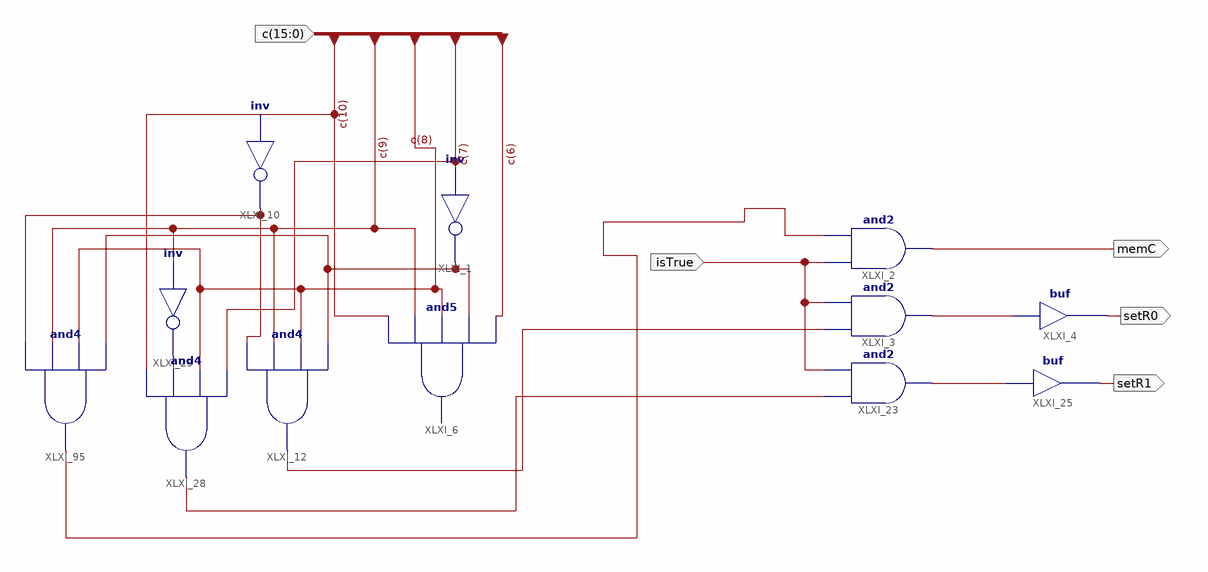
[diagram p0: schematic sheet 1]
// Xilinx ISE schematic MVI.sch (spartan3e) as structural Verilog: 12 symbols, 5 ports
module MVI (
  input  isTrue,
  input  [15:0] c,
  output setR1,
  output setR0,
  output memC
);

  wire XLXN_27, XLXN_35, XLXN_37, XLXN_61, XLXN_62, XLXN_66, XLXN_180, XLXN_186;

  not XLXI_10 (XLXN_35, c[10]);
  not XLXI_29 (XLXN_62, c[9]);
  and XLXI_28 (XLXN_66, c[10], XLXN_62, c[8], c[7]);
  buf XLXI_25 (setR1, XLXN_61);
  and XLXI_23 (XLXN_61, XLXN_66, isTrue);
  and XLXI_12 (XLXN_37, XLXN_35, c[9], c[8], XLXN_186);
  // and5 XLXI_6 has open pins: I0=c[10], I1=c[9], I2=c[8], I3=XLXN_186, I4=c[6], O=open
  buf XLXI_4 (setR0, XLXN_27);
  and XLXI_3 (XLXN_27, XLXN_37, isTrue);
  and XLXI_2 (memC, isTrue, XLXN_180);
  not XLXI_1 (XLXN_186, c[7]);
  and XLXI_95 (XLXN_180, XLXN_35, c[9], c[8], XLXN_186);
endmodule
